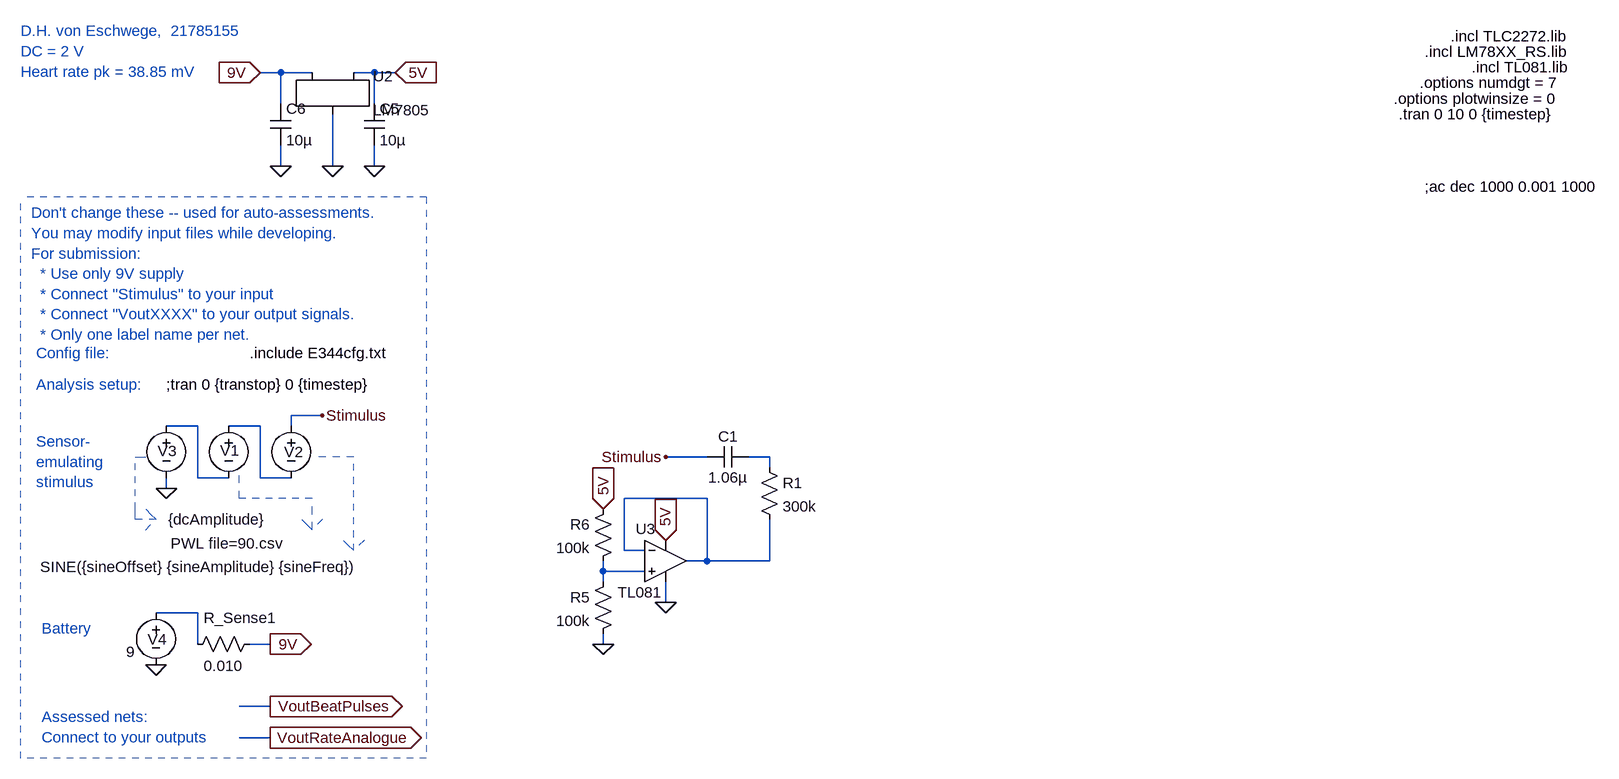
[diagram p0: schematic X_BPF_alone_test.asc]
X_BPF_alone_test.asc, the LTspice schematic file:
Version 4
SHEET 1 2960 1652
WIRE 912 480 880 480
WIRE 960 480 912 480
WIRE 1056 480 1024 480
WIRE 1088 480 1056 480
WIRE 912 528 912 480
WIRE 1056 528 1056 480
WIRE 912 624 912 592
WIRE 992 624 992 544
WIRE 1056 624 1056 592
WIRE 976 1008 928 1008
WIRE 784 1024 736 1024
WIRE 880 1024 832 1024
WIRE 928 1024 928 1008
WIRE 1568 1072 1504 1072
WIRE 1664 1072 1632 1072
WIRE 1664 1088 1664 1072
WIRE 784 1104 784 1024
WIRE 832 1104 784 1104
WIRE 880 1104 880 1024
WIRE 928 1104 880 1104
WIRE 736 1120 736 1104
WIRE 1568 1136 1440 1136
WIRE 1440 1216 1440 1136
WIRE 1472 1216 1440 1216
WIRE 1568 1232 1568 1136
WIRE 1568 1232 1536 1232
WIRE 1664 1232 1664 1168
WIRE 1664 1232 1568 1232
WIRE 1408 1248 1408 1232
WIRE 1472 1248 1408 1248
WIRE 1408 1264 1408 1248
WIRE 1504 1296 1504 1264
WIRE 784 1312 720 1312
WIRE 784 1360 784 1312
WIRE 896 1360 864 1360
WIRE 1408 1360 1408 1344
WIRE 896 1456 848 1456
WIRE 896 1504 848 1504
FLAG 736 1120 0
FLAG 976 1008 Stimulus
FLAG 896 1360 9V
IOPIN 896 1360 Out
FLAG 720 1392 0
FLAG 896 1456 VoutBeatPulses
IOPIN 896 1456 Out
FLAG 896 1504 VoutRateAnalogue
IOPIN 896 1504 Out
FLAG 992 624 0
FLAG 880 480 9V
IOPIN 880 480 In
FLAG 912 624 0
FLAG 1056 624 0
FLAG 1088 480 5V
IOPIN 1088 480 In
FLAG 1408 1360 0
FLAG 1408 1152 5V
IOPIN 1408 1152 In
FLAG 1504 1296 0
FLAG 1504 1200 5V
IOPIN 1504 1200 In
FLAG 1504 1072 Stimulus
SYMBOL res 1648 1072 R0
SYMATTR InstName R1
SYMATTR Value 300k
SYMBOL cap 1632 1056 R90
WINDOW 0 0 32 VBottom 2
WINDOW 3 32 32 VTop 2
SYMATTR InstName C1
SYMATTR Value 1.06µ
SYMBOL voltage 832 1008 R0
WINDOW 123 0 0 Left 0
WINDOW 39 0 0 Left 0
WINDOW 3 -89 197 Left 2
WINDOW 0 -13 54 Left 2
SYMATTR Value PWL file=90.csv
SYMATTR InstName V1
SYMBOL voltage 928 1008 R0
WINDOW 123 24 44 Left 2
WINDOW 39 0 0 Left 0
WINDOW 3 -386 233 Left 2
WINDOW 0 -11 56 Left 2
SYMATTR Value SINE({sineOffset} {sineAmplitude} {sineFreq})
SYMATTR InstName V2
SYMBOL voltage 736 1008 R0
WINDOW 123 0 0 Left 0
WINDOW 39 0 0 Left 0
WINDOW 3 3 160 Left 2
WINDOW 0 -13 55 Left 2
SYMATTR Value {dcAmplitude}
SYMATTR InstName V3
SYMBOL voltage 720 1296 R0
WINDOW 123 24 44 Left 2
WINDOW 39 0 0 Left 0
WINDOW 3 -46 76 Left 2
WINDOW 0 -13 57 Left 2
SYMATTR Value 9
SYMATTR InstName V4
SYMBOL res 880 1344 R90
WINDOW 0 -9 30 VBottom 2
WINDOW 3 34 56 VTop 2
SYMATTR InstName R_Sense1
SYMATTR Value 0.010
SYMBOL LM7805 992 496 R0
SYMATTR InstName U2
SYMBOL cap 1040 528 R0
SYMATTR InstName C5
SYMATTR Value 10µ
SYMBOL cap 896 528 R0
SYMATTR InstName C6
SYMATTR Value 10µ
SYMBOL res 1424 1248 M0
SYMATTR InstName R5
SYMATTR Value 100k
SYMBOL res 1424 1136 M0
SYMATTR InstName R6
SYMATTR Value 100k
SYMBOL Opamps\\opamp2 1504 1168 R0
WINDOW 0 -46 15 Left 2
WINDOW 3 -74 112 Left 2
SYMATTR InstName U3
SYMATTR Value TL081
TEXT 736 960 Left 2 !;tran 0 {transtop} 0 {timestep}
TEXT 864 912 Left 2 !.include E344cfg.txt
TEXT 528 696 Left 2 ;Don't change these -- used for auto-assessments.\nYou may modify input files while developing.\nFor submission: \n  * Use only 9V supply \n  * Connect "Stimulus" to your input\n  * Connect "VoutXXXX" to your output signals.\n  * Only one label name per net.
TEXT 536 912 Left 2 ;Config file:
TEXT 536 960 Left 2 ;Analysis setup:
TEXT 544 1336 Left 2 ;Battery
TEXT 536 1048 Left 2 ;Sensor-\nemulating \nstimulus
TEXT 544 1472 Left 2 ;Assessed nets:\nConnect to your outputs
TEXT 512 416 Left 2 ;D.H. von Eschwege,  21785155\nDC = 2 V\nHeart rate pk = 38.85 mV
TEXT 2712 424 Left 2 !.incl TLC2272.lib
TEXT 2672 448 Left 2 !.incl LM78XX_RS.lib
TEXT 2744 472 Left 2 !.incl TL081.lib
TEXT 2664 496 Left 2 !.options numdgt = 7
TEXT 2624 520 Left 2 !.options plotwinsize = 0
TEXT 2672 656 Left 2 !;ac dec 1000 0.001 1000
TEXT 2632 544 Left 2 !.tran 0 10 0 {timestep}
LINE Normal 1024 1072 960 1072 2
LINE Normal 1024 1216 1024 1072 2
LINE Normal 1008 1200 1024 1216 2
LINE Normal 1024 1216 1008 1200 2
LINE Normal 1040 1200 1024 1216 2
LINE Normal 688 1072 704 1072 2
LINE Normal 688 1152 688 1072 2
LINE Normal 688 1168 688 1152 2
LINE Normal 720 1168 688 1168 2
LINE Normal 704 1152 720 1168 2
LINE Normal 720 1168 704 1152 2
LINE Normal 704 1184 720 1168 2
LINE Normal 848 1136 848 1088 2
LINE Normal 960 1136 848 1136 2
LINE Normal 960 1184 960 1136 2
LINE Normal 944 1168 960 1184 2
LINE Normal 960 1184 944 1168 2
LINE Normal 976 1168 960 1184 2
LINE Normal 512 1536 512 672 1
LINE Normal 1136 672 1136 1536 1
LINE Normal 1136 1536 512 1536 1
LINE Normal 1136 672 512 672 1

The netlist it stands for:
* X_BPF_alone_test.asc
R1 N003 N004 300k
C1 N003 Stimulus 1.06µ
V1 N002 N001 PWL file=90.csv
V2 Stimulus N002 SINE({sineOffset} {sineAmplitude} {sineFreq})
V3 N001 0 {dcAmplitude}
V4 N006 0 9
R_Sense1 9V N006 0.010
XU2 9V 0 5V LM7805
C5 5V 0 10µ
C6 9V 0 10µ
R5 N005 0 100k
R6 5V N005 100k
XU3 N005 N004 5V 0 N004 TL081  ; pins In+ In- V+ V- OUT
;tran 0 {transtop} 0 {timestep}
.include E344cfg.txt
* Don't change these -- used for auto-assessments.
* You may modify input files while developing.
* For submission:
*   * Use only 9V supply
*   * Connect "Stimulus" to your input
*   * Connect "VoutXXXX" to your output signals.
*   * Only one label name per net.
* Config file:
* Analysis setup:
* Battery
* Sensor-
* emulating
* stimulus
* Assessed nets:
* Connect to your outputs
* D.H. von Eschwege,  21785155
* DC = 2 V
* Heart rate pk = 38.85 mV
.incl TLC2272.lib
.incl LM78XX_RS.lib
.incl TL081.lib
.options numdgt = 7
.options plotwinsize = 0
;ac dec 1000 0.001 1000
.tran 0 10 0 {timestep}
.backanno
.end